# EAGLE schematic stepdowen (EAGLE 9.4.2)
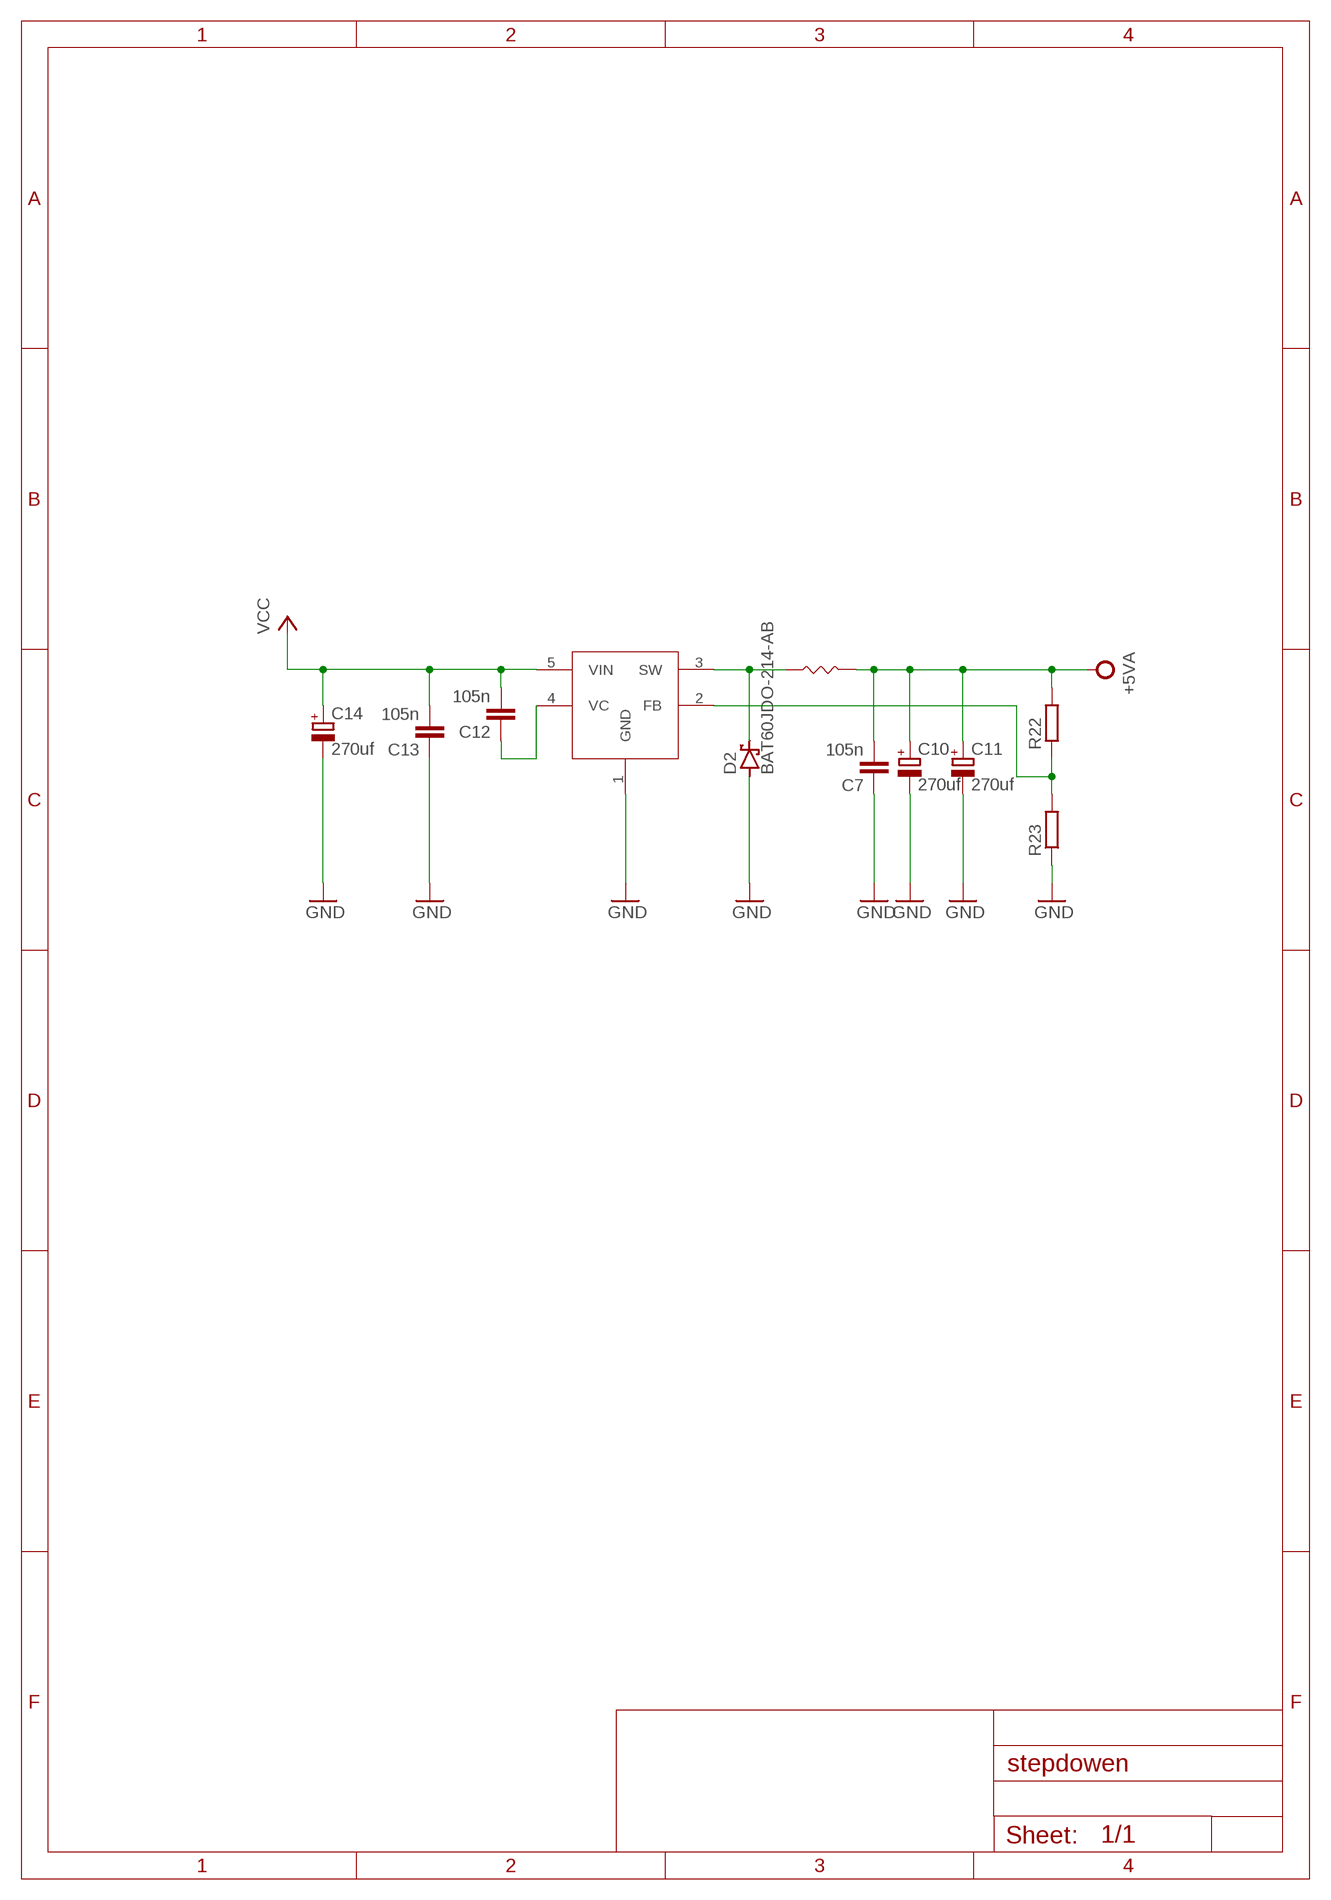
[diagram p0: schematic, sheet 1]

## Parts
C7  105n  C-EUC0603  [C0603]
C10  270uf  CPOL-EU140CLH-1010  [140CLH-1010]
C11  270uf  CPOL-EU140CLH-1010  [140CLH-1010]
C12  105n  C-EUC0603  [C0603]
C13  105n  C-EUC0603  [C0603]
C14  270uf  CPOL-EU140CLH-1010  [140CLH-1010]
D2  BAT60JDO-214-AB  [DO214BA]
R22  R-EU_R0402  [R0402]
R23  R-EU_R0402  [R0402]
U$2  LX4015  [TO-263-5]
U$3  SRP1265  [3R3-1510]

## Nets
+5VA: C7.2 C10.+ C11.+ R22.2 U$3.P$2
GND: C7.1 C10.- C11.- C13.1 C14.- D2.A R23.1 U$2.1(GND)
N$4: C12.1 U$2.4(VC)
N$5: R22.1 R23.2 U$2.2(FB)
VCC: C12.2 C13.2 C14.+ U$2.5(VIN)
VCC1: D2.C U$2.3(SW) U$3.P$1

## Library data of the parts
C7 C12 C13 = rcl:C-EU: CAPACITOR, European symbol; SPICEPREFIX: C
C10 C11 C14 = rcl:CPOL-EU: POLARIZED CAPACITOR, European symbol; SPICEPREFIX: C
D2 = diode:BAT60J: Schottky barrier diode Source: www.st.com, BAT60J.pdf
R22 R23 = rcl:R-EU_: RESISTOR, European symbol; SPICEPREFIX: R
U$2 = RB3202:LX4015
U$3 = RB3202:SRP1265

## Net classes
0 default: width 0.2 mm, drill 0.35 mm, clearance 0.2 mm